# EAGLE design board-1.1 (EAGLE 9.5.2)
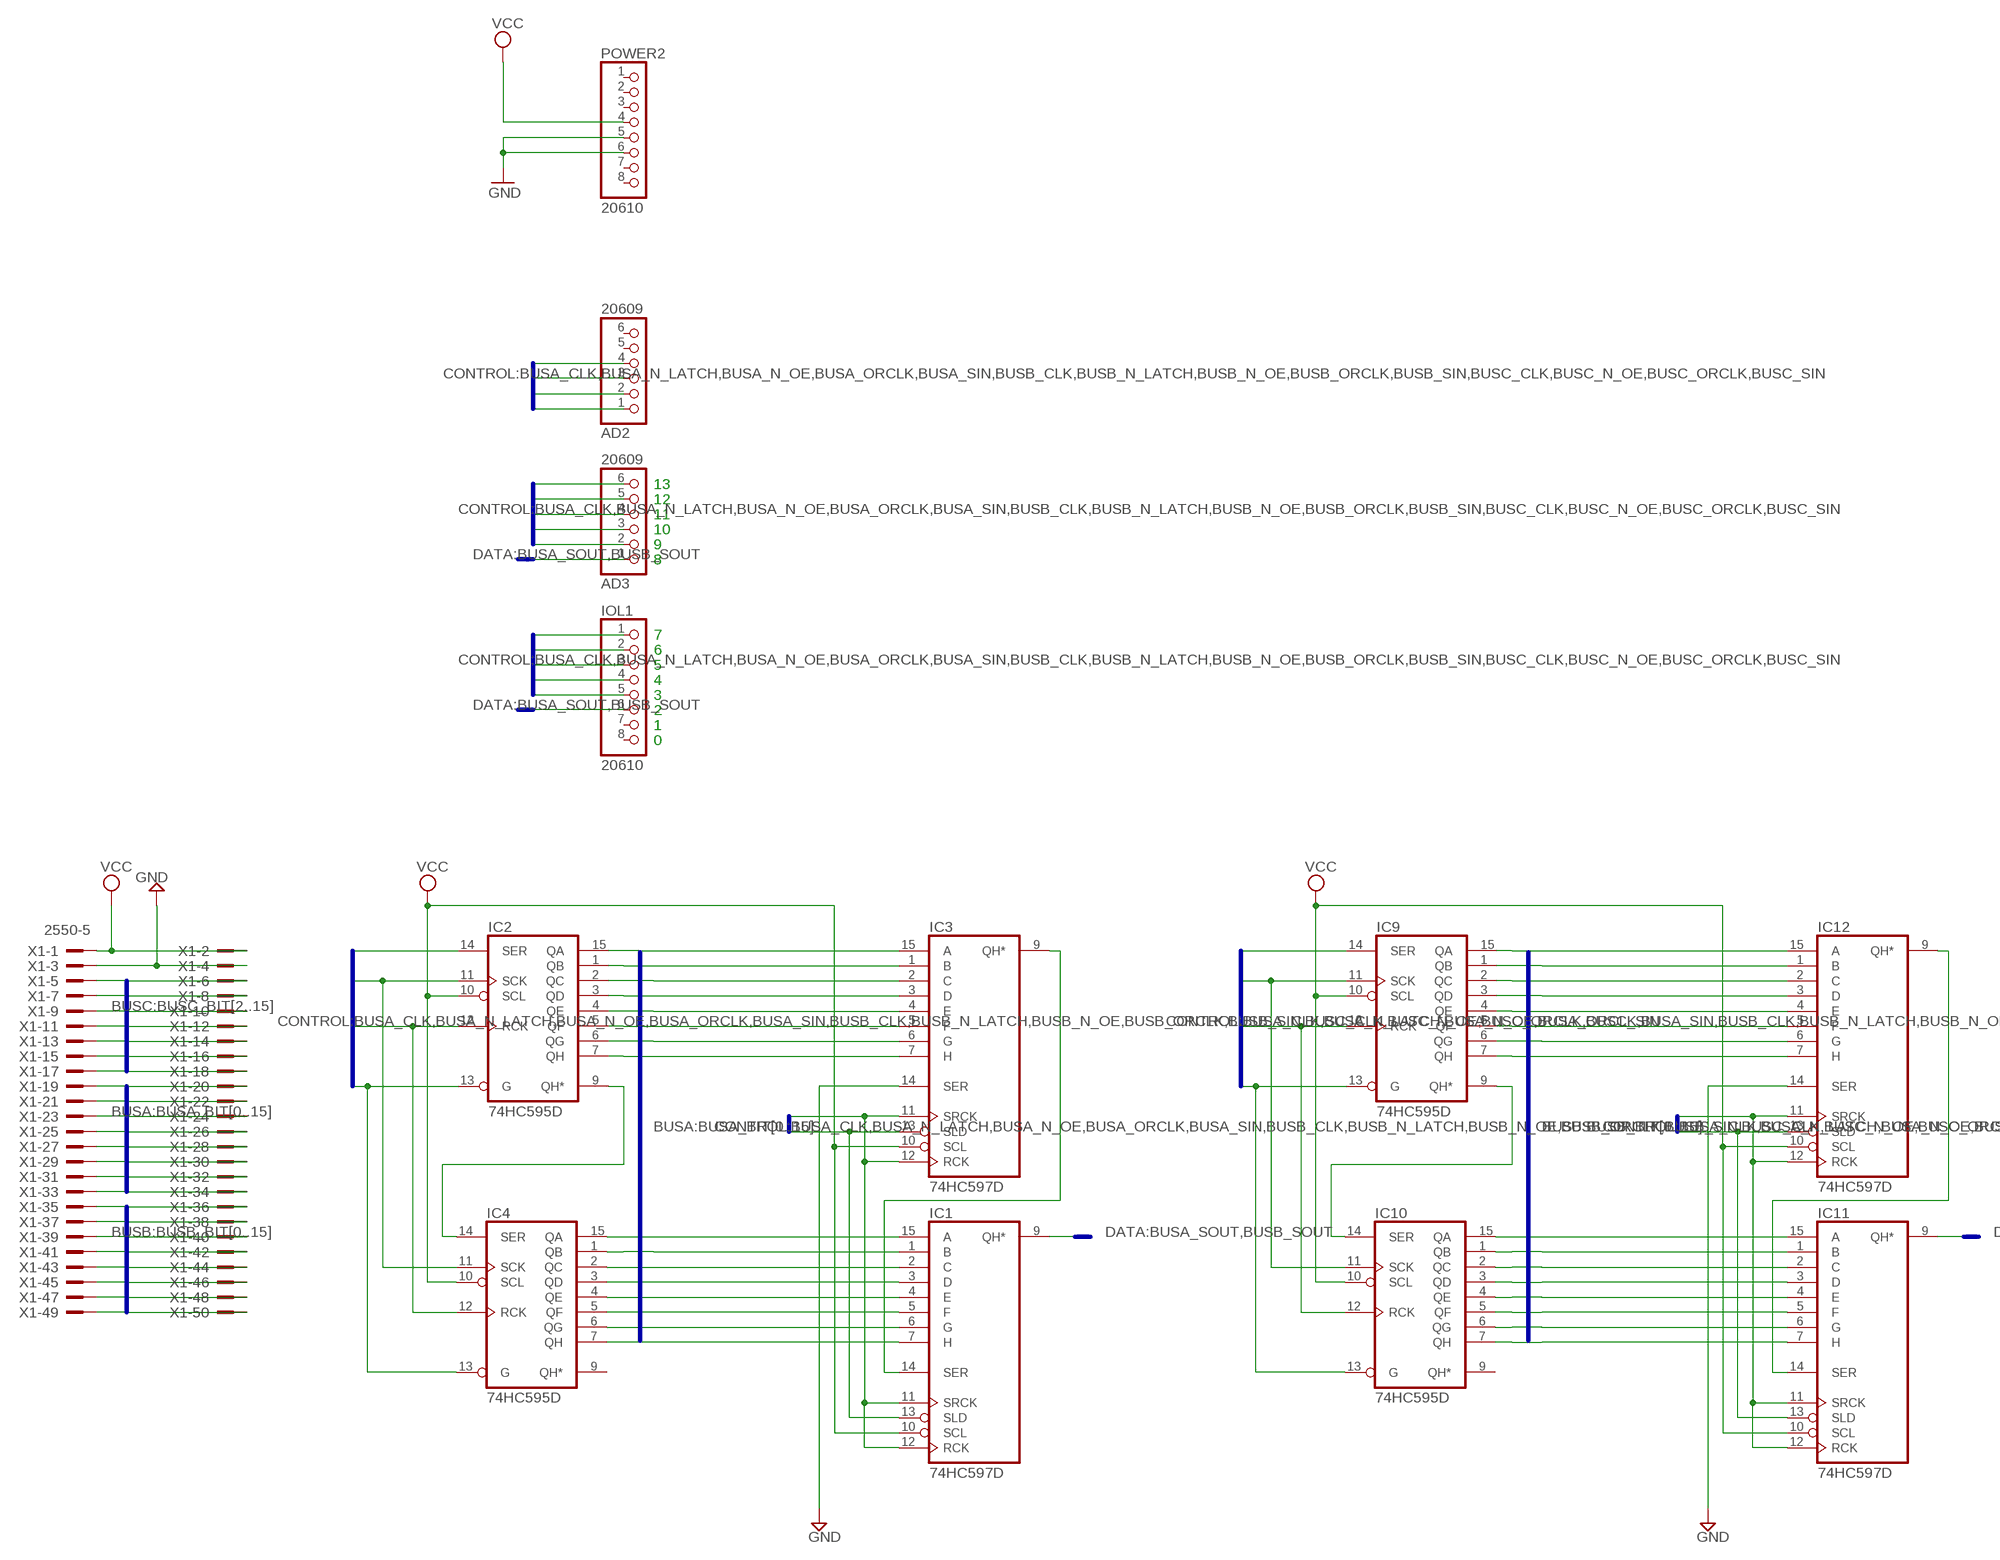
[diagram p0: schematic, sheet 1, part 1 of 2]
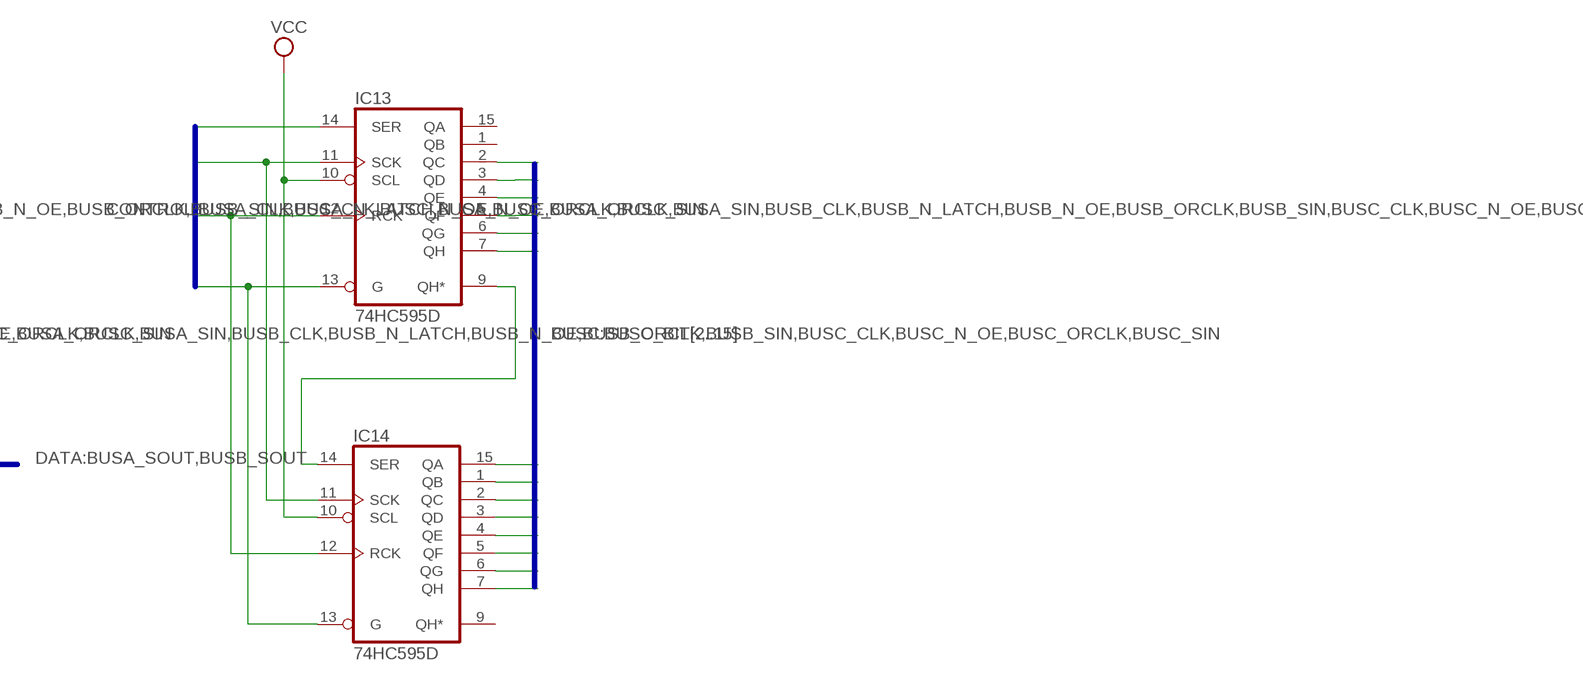
[diagram p1: schematic, sheet 1, part 2 of 2]

## Parts
AD2  20609  HEADER-1X6ROUND  [1X06_ROUND]
AD3  20609  HEADER-1X6ROUND  [1X06_ROUND]
IC1  74HC597D  [SO16]
IC2  74HC595D  [SO16]
IC3  74HC597D  [SO16]
IC4  74HC595D  [SO16]
IC9  74HC595D  [SO16]
IC10  74HC595D  [SO16]
IC11  74HC597D  [SO16]
IC12  74HC597D  [SO16]
IC13  74HC595D  [SO16]
IC14  74HC595D  [SO16]
IOL1  20610  HEADER-1X8ROUND  [1X08_ROUND]
POWER2  20610  HEADER-1X870MIL  [1X08_ROUND_70]
X1  2550-5  [PAK100/2500-5-50]

## Nets
BUSA_BIT0: IC2.15(QA) IC3.15(A) X1.19
BUSA_BIT1: IC2.1(QB) IC3.1(B) X1.20
BUSA_BIT2: IC2.2(QC) IC3.2(C) X1.21
BUSA_BIT3: IC2.3(QD) IC3.3(D) X1.22
BUSA_BIT4: IC2.4(QE) IC3.4(E) X1.23
BUSA_BIT5: IC2.5(QF) IC3.5(F) X1.24
BUSA_BIT6: IC2.6(QG) IC3.6(G) X1.25
BUSA_BIT7: IC2.7(QH) IC3.7(H) X1.26
BUSA_BIT8: IC1.15(A) IC4.15(QA) X1.27
BUSA_BIT9: IC1.1(B) IC4.1(QB) X1.28
BUSA_BIT10: IC1.2(C) IC4.2(QC) X1.29
BUSA_BIT11: IC1.3(D) IC4.3(QD) X1.30
BUSA_BIT12: IC1.4(E) IC4.4(QE) X1.31
BUSA_BIT13: IC1.5(F) IC4.5(QF) X1.32
BUSA_BIT14: IC1.6(G) IC4.6(QG) X1.33
BUSA_BIT15: IC1.7(H) IC4.7(QH) X1.34
BUSA_CLK: AD3.2 IC1.11(SRCK) IC1.12(RCK) IC2.11(SCK) IC3.11(SRCK) IC3.12(RCK) IC4.11(SCK)
BUSA_N_LATCH: AD3.3 IC1.13(SLD) IC3.13(SLD)
BUSA_N_OE: AD3.4 IC2.13(G) IC4.13(G)
BUSA_ORCLK: AD3.6 IC2.12(RCK) IC4.12(RCK)
BUSA_SIN: AD3.5 IC2.14(SER)
BUSA_SOUT: AD3.1 IC1.9(QH*)
BUSB_BIT0: IC9.15(QA) IC12.15(A) X1.35
BUSB_BIT1: IC9.1(QB) IC12.1(B) X1.36
BUSB_BIT2: IC9.2(QC) IC12.2(C) X1.37
BUSB_BIT3: IC9.3(QD) IC12.3(D) X1.38
BUSB_BIT4: IC9.4(QE) IC12.4(E) X1.39
BUSB_BIT5: IC9.5(QF) IC12.5(F) X1.40
BUSB_BIT6: IC9.6(QG) IC12.6(G) X1.41
BUSB_BIT7: IC9.7(QH) IC12.7(H) X1.42
BUSB_BIT8: IC10.15(QA) IC11.15(A) X1.43
BUSB_BIT9: IC10.1(QB) IC11.1(B) X1.44
BUSB_BIT10: IC10.2(QC) IC11.2(C) X1.45
BUSB_BIT11: IC10.3(QD) IC11.3(D) X1.46
BUSB_BIT12: IC10.4(QE) IC11.4(E) X1.47
BUSB_BIT13: IC10.5(QF) IC11.5(F) X1.48
BUSB_BIT14: IC10.6(QG) IC11.6(G) X1.49
BUSB_BIT15: IC10.7(QH) IC11.7(H) X1.50
BUSB_CLK: IC9.11(SCK) IC10.11(SCK) IC11.11(SRCK) IC11.12(RCK) IC12.11(SRCK) IC12.12(RCK) IOL1.5
BUSB_N_LATCH: IC11.13(SLD) IC12.13(SLD) IOL1.4
BUSB_N_OE: IC9.13(G) IC10.13(G) IOL1.3
BUSB_ORCLK: IC9.12(RCK) IC10.12(RCK) IOL1.1
BUSB_SIN: IC9.14(SER) IOL1.2
BUSB_SOUT: IC11.9(QH*) IOL1.6
BUSC_BIT2: IC13.2(QC) X1.5
BUSC_BIT3: IC13.3(QD) X1.6
BUSC_BIT4: IC13.4(QE) X1.7
BUSC_BIT5: IC13.5(QF) X1.8
BUSC_BIT6: IC13.6(QG) X1.9
BUSC_BIT7: IC13.7(QH) X1.10
BUSC_BIT8: IC14.15(QA) X1.11
BUSC_BIT9: IC14.1(QB) X1.12
BUSC_BIT10: IC14.2(QC) X1.13
BUSC_BIT11: IC14.3(QD) X1.14
BUSC_BIT12: IC14.4(QE) X1.15
BUSC_BIT13: IC14.5(QF) X1.16
BUSC_BIT14: IC14.6(QG) X1.17
BUSC_BIT15: IC14.7(QH) X1.18
BUSC_CLK: AD2.1 IC13.11(SCK) IC14.11(SCK)
BUSC_N_OE: AD2.2 IC13.13(G) IC14.13(G)
BUSC_ORCLK: AD2.4 IC13.12(RCK) IC14.12(RCK)
BUSC_SIN: AD2.3 IC13.14(SER)
GND: IC3.14(SER) IC12.14(SER) POWER2.5 POWER2.6 X1.3 X1.4
N$1: IC2.9(QH*) IC4.14(SER)
N$2: IC1.14(SER) IC3.9(QH*)
N$5: IC9.9(QH*) IC10.14(SER)
N$6: IC11.14(SER) IC12.9(QH*)
N$7: IC13.9(QH*) IC14.14(SER)
VCC: IC1.10(SCL) IC2.10(SCL) IC3.10(SCL) IC4.10(SCL) IC9.10(SCL) IC10.10(SCL) IC11.10(SCL) IC12.10(SCL) IC13.10(SCL) IC14.10(SCL) POWER2.4 X1.1 X1.2
Unconnected: AD2.5 AD2.6 IC4.9(QH*) IC10.9(QH*) IC13.1(QB) IC13.15(QA) IC14.9(QH*) IOL1.7 IOL1.8 POWER2.1 POWER2.2 POWER2.3 POWER2.7 POWER2.8

## Buses
BUSA:BUSA_BIT[0..15]
CONTROL:BUSA_CLK,BUSA_N_LATCH,BUSA_N_OE,BUSA_ORCLK,BUSA_SIN,BUSB_CLK,BUSB_N_LATCH,BUSB_N_OE,BUSB_ORCLK,BUSB_SIN,BUSC_CLK,BUSC_N_OE,BUSC_ORCLK,BUSC_SIN
BUSB:BUSB_BIT[0..15]
DATA:BUSA_SOUT,BUSB_SOUT
BUSC:BUSC_BIT[2..15]

## Notes on the sheet
- 13
- 12
- 11
- 10
- 9
- 8
- 7
- 6
- 5
- 4
- 3
- 2
- 1
- 0

## Power pins joined to a net without a drawn wire
GND: IC1.8(GND) IC2.8(GND) IC3.8(GND) IC4.8(GND) IC9.8(GND) IC10.8(GND) IC11.8(GND) IC12.8(GND) IC13.8(GND) IC14.8(GND)
VCC: IC1.16(VCC) IC2.16(VCC) IC3.16(VCC) IC4.16(VCC) IC9.16(VCC) IC10.16(VCC) IC11.16(VCC) IC12.16(VCC) IC13.16(VCC) IC14.16(VCC)

## Library data of the parts
AD2 AD3 = microbuilder:HEADER-1X6: PIN HEADER
IC1 IC3 IC11 IC12 = 74xx-eu:74*597: 8-bit SHIFT REGISTER, input latch
IC2 IC4 IC9 IC10 IC13 IC14 = 74xx-eu:74*595: 8-bit SHIFT REGISTER, output latch
IOL1 POWER2 = microbuilder:HEADER-1X8: PIN HEADER
X1 = con-3m:2550-: 3M (TM) Pak 100 4-Wall Header Source: 3M; OC_FARNELL: 1788696; OC_NEWARK: unknown

## Net classes
1 power: width 0.305 mm, drill 0.483 mm, clearance 0.203 mm
2 gnd: width 0.305 mm, drill 0.483 mm, clearance 0.203 mm
3 usbvcc: width 0.305 mm, drill 0.483 mm, clearance 0.203 mm

## Board
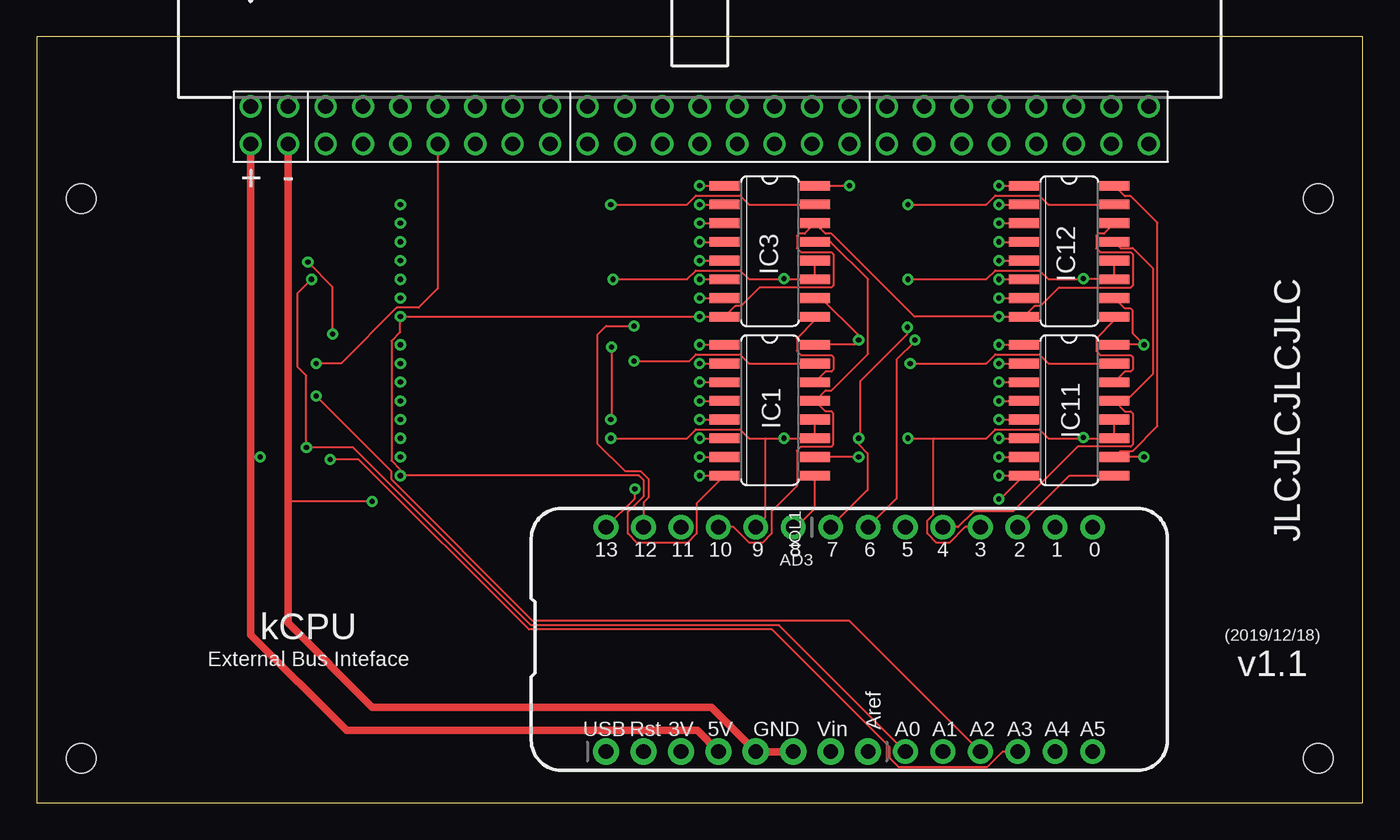
[diagram p2: board, top side]
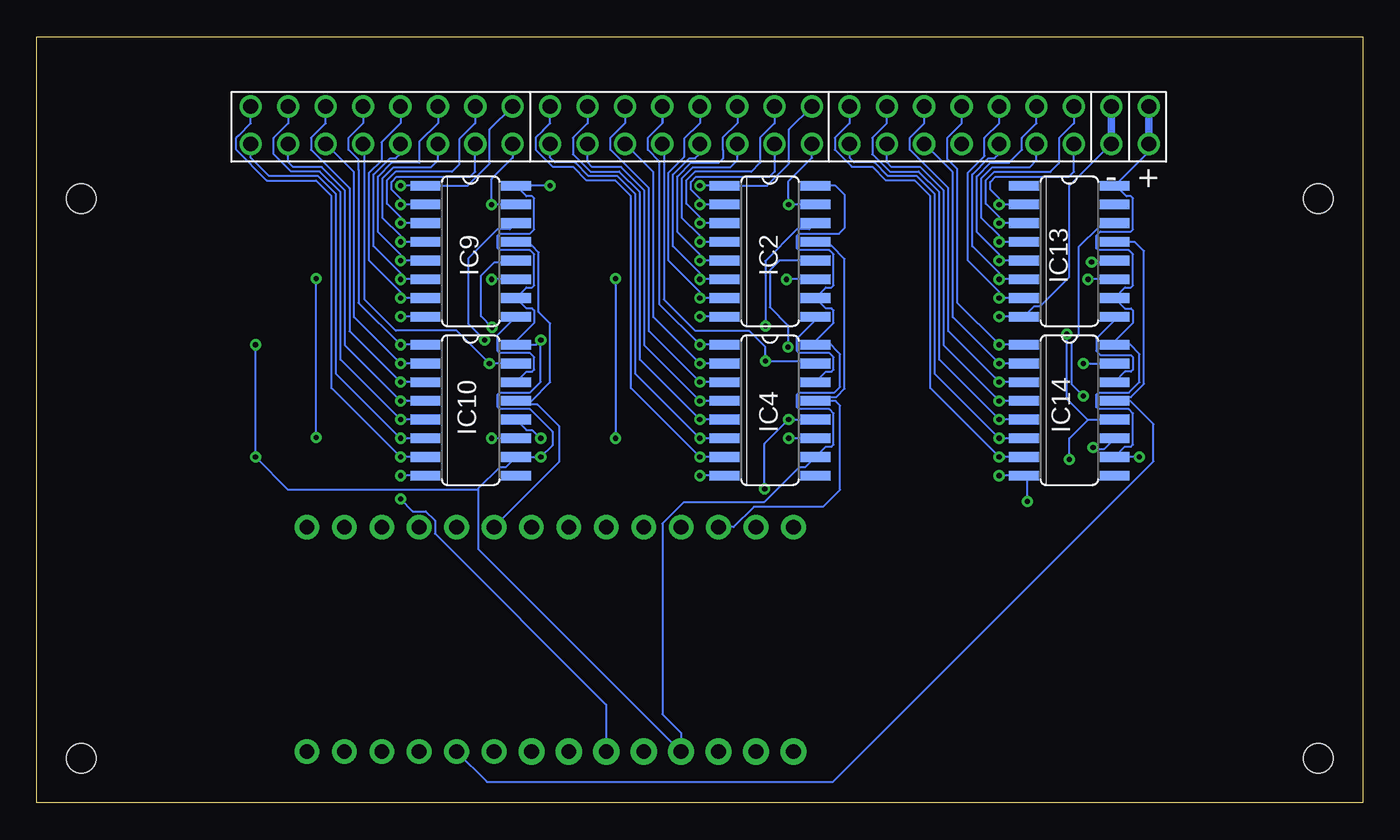
[diagram p3: board, bottom side, seen from below]

Size 90 x 52 mm. Coordinates in mm from the lower left corner, seen from the top.
Outline: 0,0 90,0 90,52 0,52 0,0
Copper layers (1*16): Top 0.035mm / dielectric 1.5mm / Bottom 0.035mm
Design rules "default": minimum track width 6mil, minimum drill 0.35mm, track to track 6mil, track to pad 6mil, pad to pad 6mil, via to via 6mil, smd to smd 6mil, copper to edge 40mil, drill to drill 6mil, minimum pad ring 10mil, minimum via ring 8mil, stop-mask expansion 4mil, vias tented up to drill 0mil, thermal gap 10mil
Holes 2 mm at 3,41 87,41 3,3 87,3

### Footprints (pad centres in the part's own frame; a part is rotated, then mirrored left to right if it is on the bottom)
1X06_ROUND = drill 1 pad 1.676: 1 -6.35,0; 2 -3.81,0; 3 -1.27,0; 4 1.27,0; 5 3.81,0; 6 6.35,0
SO16 = smd 0.66 x 2.032: 1 -4.445,-3.073; 2 -3.175,-3.073; 3 -1.905,-3.073; 4 -0.635,-3.073; 5 0.635,-3.073; 6 1.905,-3.073; 7 3.175,-3.073; 8 4.445,-3.073; 9 4.445,3.073; 10 3.175,3.073; 11 1.905,3.073; 12 0.635,3.073; 13 -0.635,3.073; 14 -1.905,3.073; 15 -3.175,3.073; 16 -4.445,3.073
1X08_ROUND = drill 1 pad 1.676: 1 -8.89,0; 2 -6.35,0; 3 -3.81,0; 4 -1.27,0; 5 1.27,0; 6 3.81,0; 7 6.35,0; 8 8.89,0
1X08_ROUND_70 = drill 1 pad 1.778: 1 -8.89,0; 2 -6.35,0; 3 -3.81,0; 4 -1.27,0; 5 1.27,0; 6 3.81,0; 7 6.35,0; 8 8.89,0
PAK100/2500-5-50 = drill 1 pad 1.422: 1 -30.48,-1.27; 2 -30.48,1.27; 3 -27.94,-1.27; 4 -27.94,1.27; 5 -25.4,-1.27; 6 -25.4,1.27; 7 -22.86,-1.27; 8 -22.86,1.27; 9 -20.32,-1.27; 10 -20.32,1.27; 11 -17.78,-1.27; 12 -17.78,1.27; 13 -15.24,-1.27; 14 -15.24,1.27; 15 -12.7,-1.27; 16 -12.7,1.27; 17 -10.16,-1.27; 18 -10.16,1.27; 19 -7.62,-1.27; 20 -7.62,1.27; 21 -5.08,-1.27; 22 -5.08,1.27; 23 -2.54,-1.27; 24 -2.54,1.27; 25 0,-1.27; 26 0,1.27; 27 2.54,-1.27; 28 2.54,1.27; 29 5.08,-1.27; 30 5.08,1.27; 31 7.62,-1.27; 32 7.62,1.27; 33 10.16,-1.27; 34 10.16,1.27; 35 12.7,-1.27; 36 12.7,1.27; 37 15.24,-1.27; 38 15.24,1.27; 39 17.78,-1.27; 40 17.78,1.27; 41 20.32,-1.27; 42 20.32,1.27; 43 22.86,-1.27; 44 22.86,1.27; 45 25.4,-1.27; 46 25.4,1.27; 47 27.94,-1.27; 48 27.94,1.27; 49 30.48,-1.27; 50 30.48,1.27

### Placement (x,y rotation side)
AD2  65.31,3.47 0 top
AD3  44.99,18.71 180 top
IC1  49.76,26.65 270 top
IC2  40.23,37.44 270 bottom
IC3  49.76,37.44 270 top
IC4  40.23,26.65 270 bottom
IC9  60.55,37.44 270 bottom
IC10  60.55,26.65 270 bottom
IC11  70.08,26.65 270 top
IC12  70.08,37.44 270 top
IC13  19.91,37.44 270 bottom
IC14  19.91,26.65 270 bottom
IOL1  62.77,18.71 0 top
POWER2  47.53,3.47 0 top
X1  45,46 0 top

### Tracks (layer width: path | path; a pad name or v marks a point on that pad's centre or on a via)
BUSA_BIT0  (via drill 0.35)
  Top 0.152: IC3.15 48.35,40.62 47.75,41.22 44.74,41.22 44.14,40.62 v38.96,40.62
  Bottom 0.152: IC2.15 v38.96,40.62 38.96,42.2 37.38,43.79 X1.19
BUSA_BIT1  (via drill 0.35)
  Top 0.152: v44.99,41.89 IC3.1
  Bottom 0.152: v44.99,41.89 IC2.1 40.44,41.89 38.93,43.39 38.93,45.73 X1.20
BUSA_BIT2  (via drill 0.35)
  Top 0.152: v44.99,40.62 IC3.2
  Bottom 0.152: IC2.2 v44.99,40.62 44.99,41.03 45.6,41.64 45.6,42.14 45.25,42.49 40.26,42.49 39.91,42.84 X1.21
BUSA_BIT3  (via drill 0.35)
  Top 0.152: v44.99,39.35 IC3.3
  Bottom 0.152: IC2.3 v44.99,39.35 44.99,39.76 45.91,40.67 45.91,42.27 45.33,42.84 41.5,42.84 40.9,43.44 40.9,45.15 39.91,46.13 X1.22
BUSA_BIT4  (via drill 0.35)
  Top 0.152: v44.99,38.08 IC3.4
  Bottom 0.152: IC2.4 v44.99,38.08 44.99,38.49 46.21,39.71 46.21,42.39 45.46,43.15 42.92,43.15 42.45,43.62 X1.23
BUSA_BIT5  (via drill 0.35)
  Top 0.152: v44.99,36.81 IC3.5
  Bottom 0.152: IC2.5 v44.99,36.81 44.99,37.22 46.52,38.74 46.52,42.52 45.58,43.45 43.73,43.45 43.44,43.74 43.44,44.32 43.44,45.15 42.45,46.13 X1.24
BUSA_BIT6  (via drill 0.35)
  Top 0.152: v44.99,35.54 IC3.6
  Bottom 0.152: IC2.6 v44.99,35.54 44.99,35.95 46.82,37.77 46.82,42.64 45.71,43.75 45.31,43.75 44.99,44.07 X1.25
BUSA_BIT7  (via drill 0.35)
  Top 0.152: v44.99,34.27 IC3.7
  Bottom 0.152: IC2.7 v44.99,34.27 44.99,34.68 47.13,36.81 47.13,42.77 46.05,43.84 46.05,45.08 44.99,46.13 X1.26
BUSA_BIT8  (via drill 0.35)
  Top 0.152: v40.55,29.98 44.3,29.98 44.74,30.43 47.75,30.43 48.35,29.82 IC1.15
  Bottom 0.152: IC4.15 37.32,29.98 v40.55,29.98 40.55,30.93 41.66,32.05 45.31,32.05 47.43,34.16 47.43,44.62 X1.27
BUSA_BIT9  (via drill 0.35)
  Top 0.152: v44.99,31.09 IC1.1
  Bottom 0.152: IC4.1 v44.99,31.09 47.73,33.83 47.73,34.04 47.73,35 47.73,43.54 48.52,44.32 48.52,45.14 48.34,45.33 | X1.28 47.54,47 | 47.54,47 47.53,46.13 48.34,45.34 48.34,45.33 | 47.54,47 47.54,46.12 48.34,45.33
BUSA_BIT10  (via drill 0.35)
  Top 0.152: v44.99,29.82 IC1.2
  Bottom 0.152: IC4.2 v44.99,29.82 48.15,32.97 48.15,33.38 48.15,40.3 48.15,42.81 X1.29
BUSA_BIT11  (via drill 0.35)
  Top 0.152: v44.99,28.55 IC1.3
  Bottom 0.152: IC4.3 v44.99,28.55 48.45,32.01 48.45,41.71 51.06,44.32 51.06,45.15 50.08,46.13 X1.30
BUSA_BIT12  (via drill 0.35)
  Top 0.152: v44.99,27.28 IC1.4
  Bottom 0.152: IC4.4 v44.99,27.28 48.75,31.04 48.75,41.57 50.34,43.16 52.3,43.16 52.62,43.48 X1.31
BUSA_BIT13  (via drill 0.35)
  Top 0.152: v44.99,26.01 IC1.5
  Bottom 0.152: IC4.5 v44.99,26.01 49.06,30.08 49.06,41.44 50.47,42.85 52.42,42.85 53.6,44.03 53.6,45.14 52.62,46.12 52.62,46.13 X1.32
BUSA_BIT14  (via drill 0.35)
  Top 0.152: v44.99,24.74 IC1.6
  Bottom 0.152: IC4.6 v44.99,24.74 49.36,29.11 49.36,41.32 50.59,42.55 52.55,42.55 53.48,43.48 54.84,43.48 55.16,43.79 X1.33
BUSA_BIT15  (via drill 0.35)
  Top 0.152: v44.99,23.47 IC1.7
  Bottom 0.152: IC4.7 v44.99,23.47 49.67,28.15 49.67,41.19 50.72,42.24 52.68,42.24 53.6,43.17 54.99,43.17 56.14,44.32 56.14,45.14 55.65,45.63 55.65,45.65 55.16,46.13 X1.34
BUSA_CLK  (via drill 0.35)
  Top 0.152: v39.12,35.54 44.14,35.54 44.74,36.14 47.75,36.14 48.35,35.54 50.71,35.54 | 50.71,35.54 IC3.11 IC3.12 | IC1.12 IC1.11 v50.71,24.74 49.44,24.74 | v38.96,24.74 44.14,24.74 44.74,25.35 47.75,25.35 48.35,24.74 49.44,24.74 | 50.71,35.54 v50.71,35.59 | AD3.2 49.44,19.34 49.44,24.74
  Bottom 0.152: IC2.11 v39.12,35.54 | IC4.11 v38.96,24.74 | v50.71,35.59 v50.71,24.74
BUSA_N_LATCH
  Top 0.152: IC3.13 53.88,38.08 56.42,35.54 56.42,30.48 53.94,27.99 53.54,27.99 IC1.13 53.54,26.57 53.94,26.57 54.08,26.44 54.08,24.32 53.94,24.18 51.87,24.18 51.59,23.9 51.59,21.49 49.87,19.78 49.87,18.27 49.25,17.64 48.36,17.64 47.3,18.71 AD3.3
BUSA_N_OE
  Bottom 0.152: IC2.13 36.91,37.82 36.08,37.82 35.16,36.91 35.16,28.11 35.74,27.54 36.91,27.54 IC4.13 35.79,27.28 35.47,26.96 35.47,21.25 36.64,20.08 41.32,20.08 42.69,18.71 AD3.4
BUSA_ORCLK  (via drill 0.35)
  Top 0.152: v39.01,30.93 39.01,26.06 v38.96,26.01 | AD3.6 40.59,20.66 v40.59,21.3
  Bottom 0.152: IC2.12 39.6,36.81 40.24,36.16 40.24,33.65 39.01,32.41 v39.01,30.93 | IC4.12 v38.96,26.01 40.59,24.38 v40.59,21.3
BUSA_SIN  (via drill 0.35)
  Top 0.152: v40.55,32.36 38.65,32.36 38.04,31.76 38.04,24.4 39.93,22.51 40.99,22.51 41.51,22 41.51,20.71 41.19,20.39 AD3.5
  Bottom 0.152: IC2.14 37.57,38.94 38.4,38.94 40.55,36.79 v40.55,32.36
BUSA_SOUT
  Top 0.152: IC1.9 52.83,19.98 51.56,18.71 AD3.1
BUSB_BIT0  (via drill 0.35)
  Top 0.152: v59.12,40.62 64.46,40.62 65.06,41.22 68.07,41.22 68.67,40.62 IC12.15
  Bottom 0.152: IC9.15 v59.12,40.62 59.12,42.36 57.7,43.79 X1.35
BUSB_BIT1  (via drill 0.35)
  Top 0.152: v65.31,41.89 IC12.1
  Bottom 0.152: v65.31,41.89 IC9.1 60.76,41.89 59.25,43.39 59.25,45.73 X1.36
BUSB_BIT2  (via drill 0.35)
  Top 0.152: v65.31,40.62 IC12.2
  Bottom 0.152: IC9.2 v65.31,40.62 65.31,41.03 65.92,41.64 65.92,42.14 65.57,42.49 60.58,42.49 60.23,42.84 X1.37
BUSB_BIT3  (via drill 0.35)
  Top 0.152: v65.31,39.35 IC12.3
  Bottom 0.152: IC9.3 v65.31,39.35 65.31,39.76 66.23,40.67 66.23,42.27 65.65,42.84 61.82,42.84 61.33,43.33 61.33,45.04 60.23,46.13 X1.38
BUSB_BIT4  (via drill 0.35)
  Top 0.152: v65.31,38.08 IC12.4
  Bottom 0.152: IC9.4 v65.31,38.08 65.31,38.49 66.53,39.71 66.53,42.39 65.78,43.15 63.24,43.15 62.77,43.62 X1.39
BUSB_BIT5  (via drill 0.35)
  Top 0.152: v65.31,36.81 IC12.5
  Bottom 0.152: IC9.5 v65.31,36.81 65.31,37.22 66.84,38.74 66.84,42.52 65.9,43.45 64.05,43.45 64.05,44.87 62.77,46.13 X1.40
BUSB_BIT6  (via drill 0.35)
  Top 0.152: v65.31,35.54 IC12.6
  Bottom 0.152: IC9.6 v65.31,35.54 65.31,35.95 67.14,37.77 67.14,42.64 66.03,43.75 65.63,43.75 65.31,44.07 X1.41
BUSB_BIT7  (via drill 0.35)
  Top 0.152: v65.31,34.27 IC12.7
  Bottom 0.152: IC9.7 v65.31,34.27 65.31,34.68 67.45,36.81 67.45,42.77 66.61,43.61 66.61,44.84 65.31,46.13 X1.42
BUSB_BIT8  (via drill 0.35)
  Top 0.152: IC11.15 68.67,29.82 68.07,30.43 65.06,30.43 64.46,29.82 v59.28,29.82
  Bottom 0.152: IC10.15 v59.28,29.82 61.51,32.05 65.63,32.05 67.75,34.16 67.75,44.62 X1.43
BUSB_BIT9  (via drill 0.35)
  Top 0.152: v65.31,31.09 IC11.1
  Bottom 0.152: IC10.1 v65.31,31.09 68.11,33.89 68.16,33.94 68.16,42.98 | X1.44 67.86,46.13 68.84,45.15 68.84,44.32 68.16,43.64 68.16,43 68.16,42.98 | 68.16,42.98
BUSB_BIT10  (via drill 0.35)
  Top 0.152: v65.31,29.82 IC11.2
  Bottom 0.152: IC10.2 v65.31,29.82 68.47,32.97 68.47,33.38 68.47,40.3 68.47,42.81 X1.45
BUSB_BIT11  (via drill 0.35)
  Top 0.152: v65.31,28.55 IC11.3
  Bottom 0.152: IC10.3 v65.31,28.55 68.77,32.01 68.77,41.71 71.38,44.32 71.38,45.14 71.27,45.26 71.27,45.27 70.39,46.13 X1.46
BUSB_BIT12  (via drill 0.35)
  Top 0.152: v65.31,27.28 IC11.4
  Bottom 0.152: IC10.4 v65.31,27.28 69.07,31.04 69.07,41.57 70.66,43.16 72.62,43.16 72.94,43.48 X1.47
BUSB_BIT13  (via drill 0.35)
  Top 0.152: v65.31,26.01 IC11.5
  Bottom 0.152: IC10.5 v65.31,26.01 69.38,30.08 69.38,41.44 70.79,42.85 72.74,42.85 73.92,44.03 73.92,45.14 72.94,46.12 72.94,46.13 X1.48
BUSB_BIT14  (via drill 0.35)
  Top 0.152: v65.31,24.74 IC11.6
  Bottom 0.152: IC10.6 v65.31,24.74 69.68,29.11 69.68,41.32 70.91,42.55 73,42.55 | 73,42.55 74.23,42.55 75.47,43.79 X1.49 | 73,42.55
BUSB_BIT15  (via drill 0.35)
  Top 0.152: v65.31,23.47 IC11.7
  Bottom 0.152: IC10.7 v65.31,23.47 69.99,28.15 69.99,41.19 71.04,42.24 74.38,42.24 76.46,44.32 76.46,45.14 76.31,45.3 75.47,46.13 X1.50
BUSB_CLK  (via drill 0.35)
  Top 0.152: v59.12,35.54 64.46,35.54 65.06,36.14 68.07,36.14 68.67,35.54 71.03,35.54 | 71.03,35.54 IC12.11 IC12.12 | IC11.12 IC11.11 71.03,24.74 | v59.12,24.74 60.87,24.74 | 60.87,24.74 64.46,24.74 65.06,25.35 68.07,25.35 68.67,24.74 71.03,24.74 | IOL1.5 63.01,18.71 61.95,17.64 61.06,17.64 60.44,18.27 60.44,19.15 60.87,19.58 60.87,24.74 | 71.03,35.54 v71.03,35.59 | 71.03,24.74 v71.03,24.79
  Bottom 0.152: IC9.11 v59.12,35.54 | IC10.11 v59.12,24.74 | v71.03,24.79 v71.03,35.59
BUSB_N_LATCH
  Top 0.152: IC11.13 73.2,27.23 | 73.2,27.23 73.86,26.57 74.26,26.57 74.39,26.44 74.39,24.32 74.26,24.18 70.66,24.18 66.25,19.78 63.6,19.78 62.54,18.71 IOL1.4 | IC12.13 73.56,37.67 74.39,37.67 75.76,36.3 75.76,29.11 73.89,27.23 73.2,27.23
BUSB_N_OE
  Bottom 0.152: IC9.13 57.23,37.82 56.4,37.82 55.93,37.36 55.93,33.31 55.16,32.54 55.16,28.55 56.42,27.28 IC10.13 57.23,27.03 56.01,27.03 54.52,25.54 54.52,23.16 IOL1.3
BUSB_ORCLK  (via drill 0.35)
  Top 0.152: IOL1.1 56.4,21.22 56.4,23.72 55.79,24.33 v55.79,24.74 55.89,24.81 55.89,28.62 59.09,31.82 v59.09,32.27
  Bottom 0.152: IC10.12 56.77,25.3 56.37,25.3 55.81,24.74 v55.79,24.74 | v59.09,32.27 59.85,33.04 59.85,35.78 58.94,36.69 57.57,36.69 IC9.12
BUSB_SIN  (via drill 0.35)
  Top 0.152: v59.6,31.41 59.6,31.32 58.36,30.07 58.36,20.64 IOL1.2
  Bottom 0.152: IC9.14 57.89,38.94 58.72,38.94 60.71,36.95 60.71,32.52 v59.6,31.41
BUSB_SOUT
  Top 0.152: IOL1.6 70.08,22.2 IC11.9
BUSC_BIT2  (via drill 0.35)
  Bottom 0.152: IC13.2 v24.68,40.62 24.68,41.03 25.28,41.64 25.28,42.14 24.93,42.49 19.94,42.49 19.59,42.84 X1.5
BUSC_BIT3  (via drill 0.35)
  Bottom 0.152: IC13.3 v24.68,39.35 24.68,39.76 25.59,40.67 25.59,42.27 25.01,42.84 21.18,42.84 20.61,43.42 20.61,45.12 19.59,46.13 X1.6
BUSC_BIT4  (via drill 0.35)
  Bottom 0.152: IC13.4 v24.68,38.08 24.68,38.49 25.89,39.71 25.89,42.39 25.14,43.15 22.61,43.15 22.14,43.62 X1.7
BUSC_BIT5  (via drill 0.35)
  Bottom 0.152: IC13.5 v24.68,36.81 24.68,37.22 26.2,38.74 26.2,42.52 25.26,43.45 24,43.45 23.12,44.33 23.12,45.15 22.14,46.13 X1.8
BUSC_BIT6  (via drill 0.35)
  Bottom 0.152: IC13.6 v24.68,35.54 24.68,35.95 26.5,37.77 26.5,42.64 25.39,43.75 24.99,43.75 24.68,44.07 X1.9
BUSC_BIT7  (via drill 0.35)
  Bottom 0.152: IC13.7 v24.68,34.27 24.68,34.68 26.81,36.81 26.81,42.77 25.66,43.91 25.66,45.14 24.68,46.12 24.68,46.13 X1.10
BUSC_BIT8  (via drill 0.35)
  Top 0.152: X1.11 27.21,34.9 25.92,33.6 24.42,33.6 20.64,29.82 v18.96,29.82
  Bottom 0.152: v18.96,29.82 IC14.15
BUSC_BIT9  (via drill 0.35)
  Bottom 0.152: IC14.1 v24.68,31.09 27.52,33.94 27.52,43 28.2,43.68 28.2,45.15 27.21,46.13 X1.12
BUSC_BIT10  (via drill 0.35)
  Bottom 0.152: IC14.2 v24.68,29.82 27.82,32.97 27.82,33.38 27.82,40.3 27.82,42.81 X1.13
BUSC_BIT11  (via drill 0.35)
  Bottom 0.152: IC14.3 v24.68,28.55 28.13,32.01 28.13,41.73 30.15,43.75 30.17,43.75 30.74,44.32 30.74,45.15 29.75,46.13 X1.14
BUSC_BIT12  (via drill 0.35)
  Bottom 0.152: IC14.4 v24.68,27.28 28.43,31.04 28.43,41.57 30.02,43.16 31.98,43.16 32.3,43.48 X1.15
BUSC_BIT13  (via drill 0.35)
  Bottom 0.152: IC14.5 v24.68,26.01 28.74,30.08 28.74,41.44 30.15,42.85 32.1,42.85 33.28,44.03 33.28,45.14 33.22,45.2 33.22,45.22 32.3,46.13 X1.16
BUSC_BIT14  (via drill 0.35)
  Bottom 0.152: IC14.6 v24.68,24.74 29.04,29.11 29.04,41.32 30.27,42.55 32.23,42.55 33.16,43.48 34.52,43.48 34.84,43.79 X1.17
BUSC_BIT15  (via drill 0.35)
  Bottom 0.152: IC14.7 v24.68,23.47 29.35,28.15 29.35,41.19 30.4,42.24 32.36,42.24 33.28,43.17 34.67,43.17 35.82,44.32 35.82,45.15 34.84,46.13 X1.18
BUSC_CLK  (via drill 0.35)
  Top 0.152: v18.64,35.54 17.72,34.61 17.72,29.57 18.3,28.99 v18.3,24.11 21.48,24.11 33.53,12.05 50.38,12.05 AD2.1
  Bottom 0.152: IC14.11 17.55,24.03 18.22,24.03 v18.3,24.11 | IC13.11 v18.64,35.54
BUSC_N_OE
  Bottom 0.152: IC13.13 15.47,38.08 14.85,37.45 14.85,28.43 15.73,27.54 16.59,27.54 IC14.13 15.79,27.28 14.2,25.7 14.2,23.18 35.97,1.41 59.44,1.41 AD2.2
BUSC_ORCLK  (via drill 0.35)
  Top 0.152: AD2.4 65.55,3.47 64.49,2.4 58.52,2.4 57.9,3.03 57.9,3.74 49.89,11.75 33.41,11.75 21.84,23.31 v19.91,23.31 | v18.4,36.69 20.08,35.02 v20.08,31.82
  Bottom 0.152: v19.91,23.31 19.91,24.74 18.67,25.99 | IC14.12 18.64,26.01 18.67,25.99 | v18.4,36.69 16.88,36.69 IC13.12 | v20.08,31.82 20.08,27.4 18.67,25.99
BUSC_SIN  (via drill 0.35)
  Top 0.152: v18.96,27.6 24.07,22.49 24.07,21.95 33.66,12.36 55.16,12.36 AD2.3
  Bottom 0.152: IC13.14 17.09,39.09 17.92,39.09 19.28,37.74 19.28,31.73 19.75,31.25 19.75,28.39 v18.96,27.6
GND  (via drill 0.35)
  Top 0.152: v44.99,22.2 IC1.8 44.79,20.31 44.79,18.27 44.17,17.64 40.74,17.64 40.12,18.27 40.12,19.75 41.2,20.84 41.2,21.87 40.87,22.2 24.99,22.2 24.68,22.52 | v65.31,22.2 IC11.8 65.42,20.61 v65.31,20.61 | IC12.14 72.44,38.64 72.04,38.64 71.91,38.5 71.91,37.65 72.19,37.37 74.26,37.37 74.39,37.23 74.39,35.11 74.26,34.98 69.39,34.98 68.11,33.71 67.72,33.71 IC12.8 v65.31,33 59.58,33 53.94,38.64 53.54,38.64 IC3.14 52.12,38.64 51.72,38.64 51.59,38.5 51.59,37.65 51.87,37.37 53.94,37.37 54.08,37.23 54.08,35.11 53.94,34.98 49.06,34.98 47.8,33.71 47.4,33.71 IC3.8 v44.99,33 v24.68,33 24.68,31.95 24.07,31.34 24.07,23.22 24.68,22.61 24.68,22.52 | v24.68,22.2 24.68,22.52 | v22.77,20.46 17.05,20.46
  Top 0.508: X1.3 17.05,20.46 17.05,12.2 22.77,6.49 45.79,6.49 POWER2.5 POWER2.6
  Bottom 0.152: IC2.8 v44.99,33 | IC4.8 v44.99,22.2 | IC9.8 v65.31,33 | IC10.8 v65.31,22.2 | v24.68,33 IC13.8 22.27,33.71 21.88,33.71 19.91,35.67 19.91,41.89 X1.3 | v24.68,22.2 IC14.8 22.77,22.2 v22.77,20.46 | POWER2.6 51.34,6.64 62.98,18.28 62.98,19.15 63.6,19.78 64.48,19.78 v65.31,20.61
  Bottom 0.5: X1.3 X1.4
N$1
  Bottom 0.152: IC4.14 36.45,29.26 36.05,29.26 35.91,29.4 35.91,30.25 36.2,30.53 38.27,30.53 38.4,30.67 38.4,31.52 37.16,32.76 IC2.9
N$2
  Top 0.152: IC3.9 52.83,32.76 51.59,31.52 51.59,30.67 51.87,30.38 53.94,30.38 54.08,30.25 54.08,29.4 53.94,29.26 53.54,29.26 IC1.14
N$5
  Bottom 0.152: IC10.14 56.77,29.26 56.37,29.26 56.23,29.4 56.23,30.25 56.52,30.53 58.59,30.53 58.72,30.67 58.72,31.75 IC9.9
N$6
  Top 0.152: IC12.9 73.15,32.76 71.91,31.52 71.91,30.67 72.19,30.38 74.26,30.38 74.39,30.25 74.39,29.4 74.26,29.26 73.86,29.26 IC11.14
N$7
  Bottom 0.152: IC13.9 16.84,32.76 18.08,31.52 18.08,30.67 17.8,30.38 15.73,30.38 15.6,30.25 15.6,29.4 15.73,29.26 16.13,29.26 IC14.14
VCC  (via drill 0.35)
  Top 0.152: IC3.16 v55.16,41.89 | IC3.10 53.23,34.27 55.79,31.71 v55.79,31.41 55.47,31.09 IC1.16 | 14.52,23.79 14.83,23.47 v15.15,23.47 | v55.79,23.47 IC1.10 | v75.16,23.47 IC11.10 73.56,23.88 74.39,23.88 76.07,25.56 76.07,39.37 74.26,41.18 73.86,41.18 IC12.16 | IC11.16 v75.16,31.09 74.39,31.86 74.39,33.42 74.26,33.56 73.86,33.56 IC12.10
  Top 0.508: X1.1 14.52,23.79 14.52,11.41 21.02,4.9 44.84,4.9 POWER2.4
  Bottom 0.152: IC13.16 16.79,41.94 | 16.79,41.94 14.52,44.21 X1.1 | 16.79,41.94 16.03,41.18 15.73,41.18 15.6,41.04 15.6,38.92 15.73,38.79 17.8,38.79 18.08,38.5 18.08,37.65 17.95,37.52 15.88,37.52 15.6,37.23 15.6,35.11 15.73,34.98 16.13,34.98 IC13.10 16.13,33.56 15.73,33.56 15.6,33.42 15.6,32.57 16.84,31.33 IC14.16 15.79,31.09 15.15,30.46 15.15,28.55 15.86,27.84 17.95,27.84 18.08,27.71 18.08,26.86 17.95,26.72 15.88,26.72 15.6,26.44 15.6,24.32 15.73,24.18 16.13,24.18 IC14.10 v15.15,23.47 | 37.16,31.33 36.34,31.33 35.47,30.46 35.47,28.23 35.86,27.84 38.27,27.84 38.4,27.71 38.4,26.86 38.27,26.72 36.2,26.72 35.91,26.44 35.91,24.32 36.05,24.18 36.45,24.18 IC4.10 37.87,22.76 38.27,22.76 40.65,20.39 46.1,20.39 47.53,18.95 47.53,6.01 46.27,4.74 POWER2.4 60.03,17.24 60.03,21.25 | IC4.16 37.16,31.33 | 37.16,31.33 35.91,32.57 35.91,33.42 36.05,33.56 36.45,33.56 IC2.10 36.45,34.98 36.05,34.98 35.91,35.11 35.91,37.23 36.2,37.52 38.27,37.52 38.4,37.65 38.4,38.5 38.27,38.64 35.55,38.64 35.15,39.03 35.15,41.25 35.79,41.89 IC2.16 | 60.03,21.25 60.03,21.32 58.59,22.76 58.19,22.76 IC10.10 v55.79,23.47 55,24.27 55,25.2 56.52,26.72 58.59,26.72 58.72,26.86 58.72,27.71 58.59,27.84 56.52,27.84 55.79,28.57 v55.79,31.41 56.11,31.09 IC10.16 57.48,31.33 56.23,32.57 56.23,33.42 56.37,33.56 56.77,33.56 IC9.10 56.77,34.98 56.37,34.98 56.23,35.11 56.23,37.23 56.52,37.52 58.59,37.52 58.72,37.65 58.72,38.5 58.59,38.64 56.52,38.64 56.23,38.92 56.23,41.04 56.37,41.18 56.77,41.18 IC9.16 v55.16,41.89 | 60.03,21.25 72.94,21.25 v75.16,23.47 v75.16,31.09
  Bottom 0.5: X1.1 X1.2

### Text on the board
tPlace: 13 | 12 | 11 | 10 | 9 | 8 | 7 | 6 | 5 | 4 | 3 | 2 | 1 | 0 | Aref | USB | Rst | 3V | 5V | GND | Vin | A0 | A1 | A2 | A3 | A4 | A5
tNames: - | - | - | + | + | + | JLCJLCJLCJLC | kCPU | (2019/12/18) | External Bus Inteface | v1.1
bNames: - | +
214bmp: D:/SmartProjects/Snc/a4_bn_logo2.bmp